# EAGLE schematic getPosition-EAGLE-V1 (EAGLE 9.6.2)
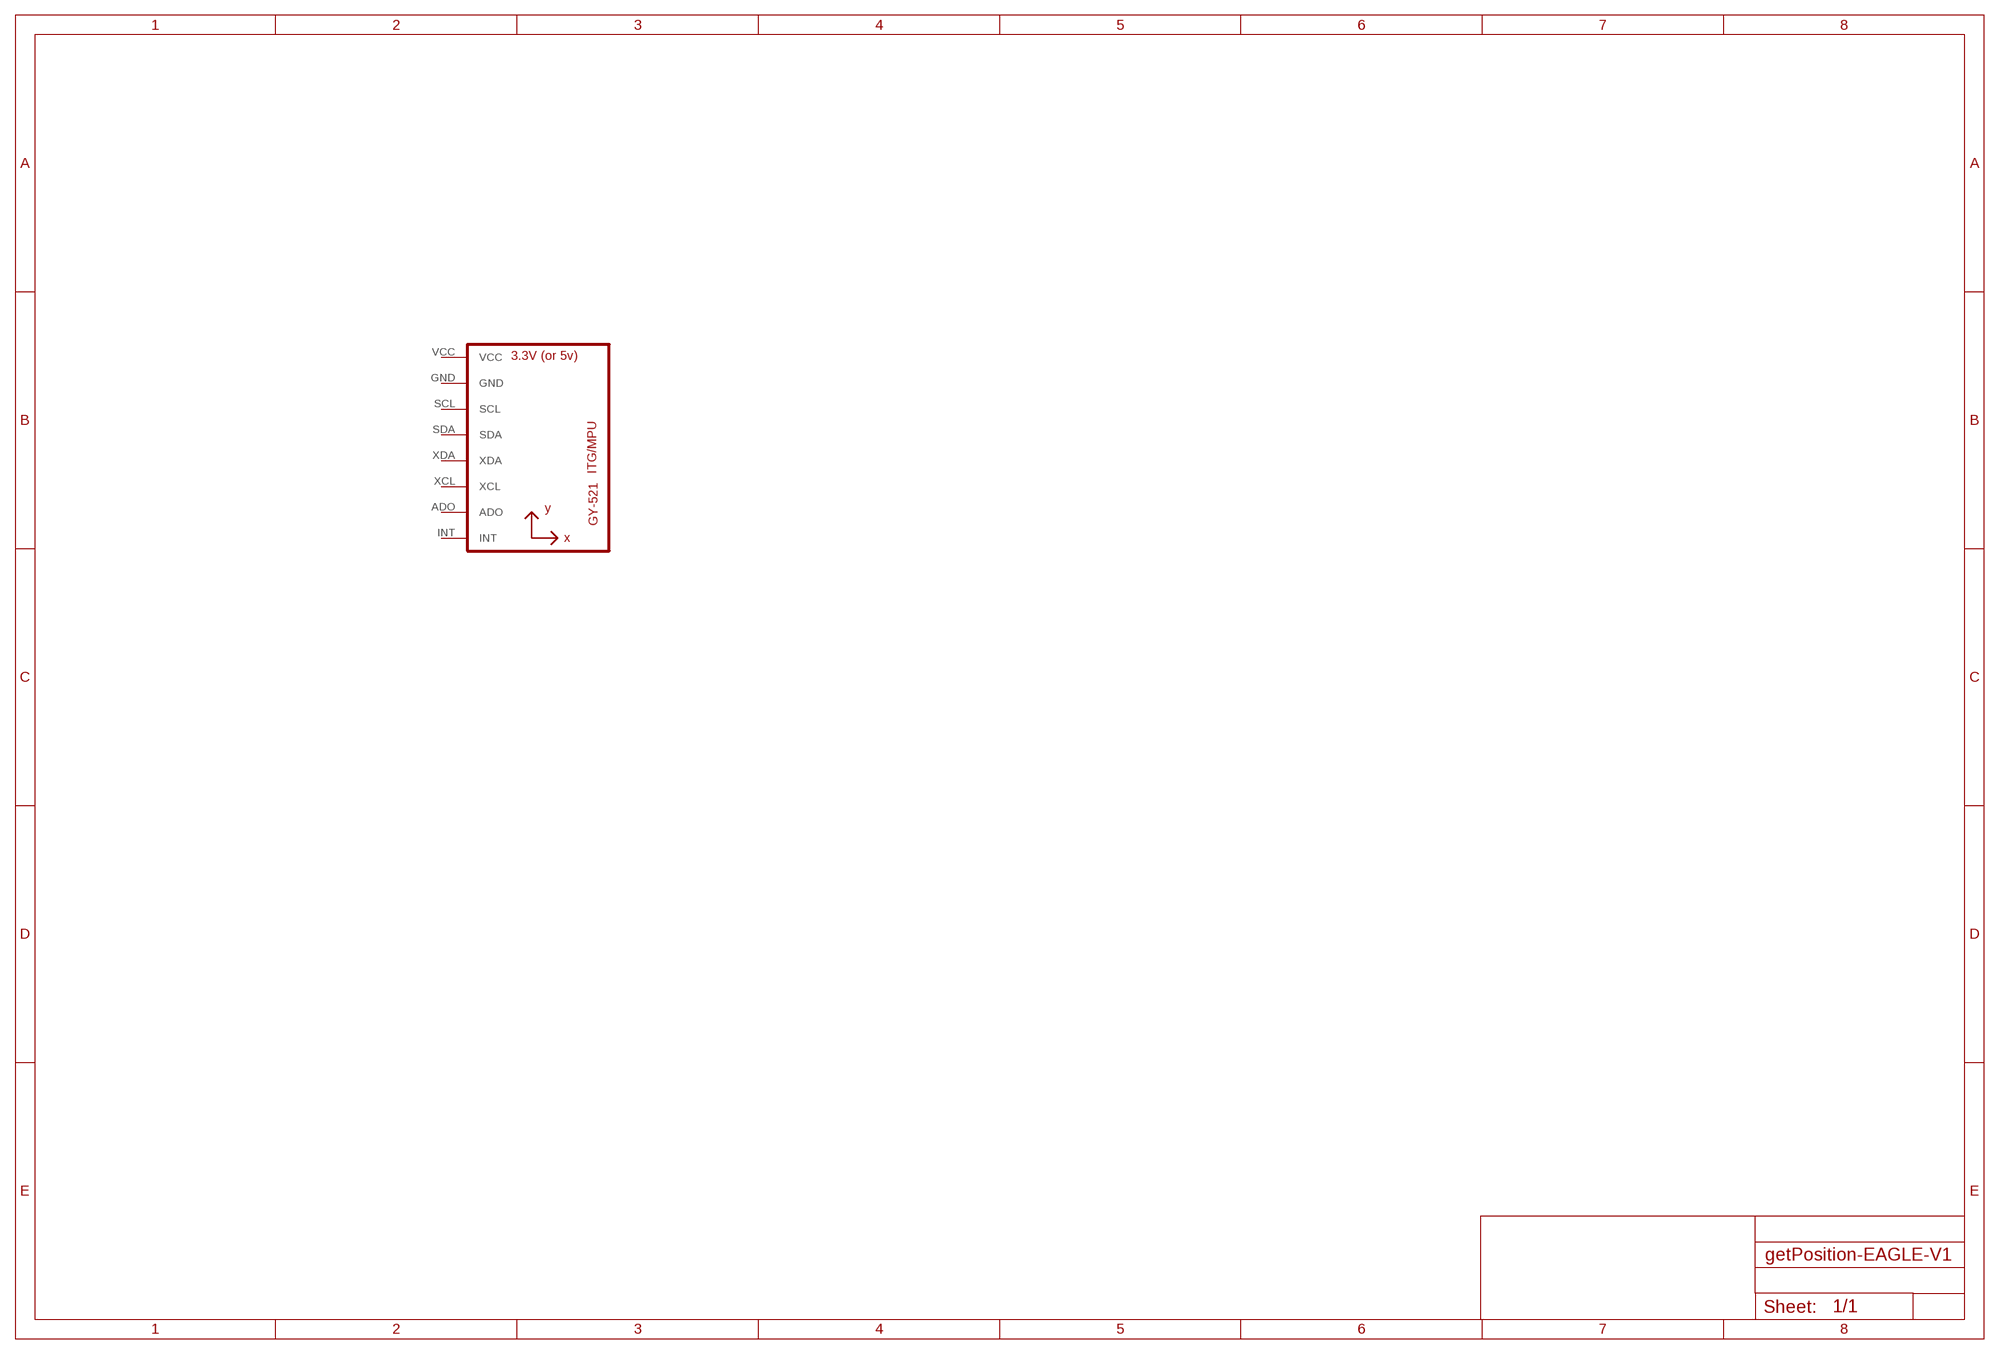
[diagram p0: schematic, sheet 1]

## Parts
U1  GY-521MPU6050  [GY-521]
Unconnected: U1.ADO U1.GND U1.INT U1.SCL U1.SDA U1.VCC U1.XCL U1.XDA

## Library data of the parts
U1 = eventHorizon:GY-521

## Net classes
1 power: width 0.61 mm, drill 0.406 mm, clearance 0.203 mm
2 gnd: width 0.305 mm, drill 0.406 mm, clearance 0.203 mm
3 power usb: width 0.508 mm, drill 0.406 mm, clearance 0.203 mm